# EAGLE design rj45test (EAGLE 5.09)
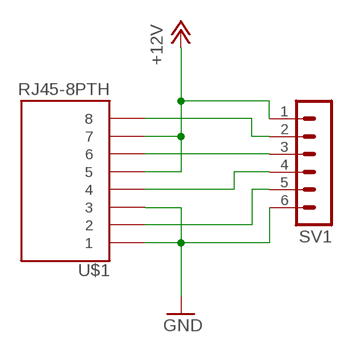
[diagram p0: schematic, sheet 1]

## Parts
SV1  MA06-1  [MA06-1]
U$1  RJ45-8PTH  [RJ45-8]

## Nets
+12V: SV1.1 U$1.5 U$1.7
GND: SV1.6 U$1.1 U$1.3
N$2: SV1.2 U$1.8
N$3: SV1.3 U$1.6
N$4: SV1.4 U$1.4
N$5: SV1.5 U$1.2

## Library data of the parts
SV1 = con-lstb:MA06-1: PIN HEADER
U$1 = SparkFun:RJ45-8: RJ45 Jack Simple RJ45, 8-pin connection - connector for common Cat5, Cat5e, and Cat6 Ethernet cables. Footprint not yet proven in production. Connector sku is PRT-00643; Breakout PCB sku is BOB-00716.

## Board
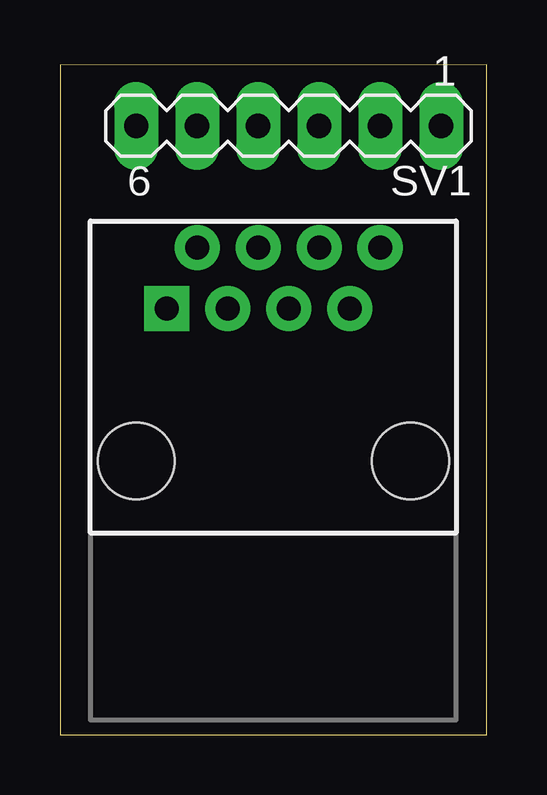
[diagram p1: board, top side]
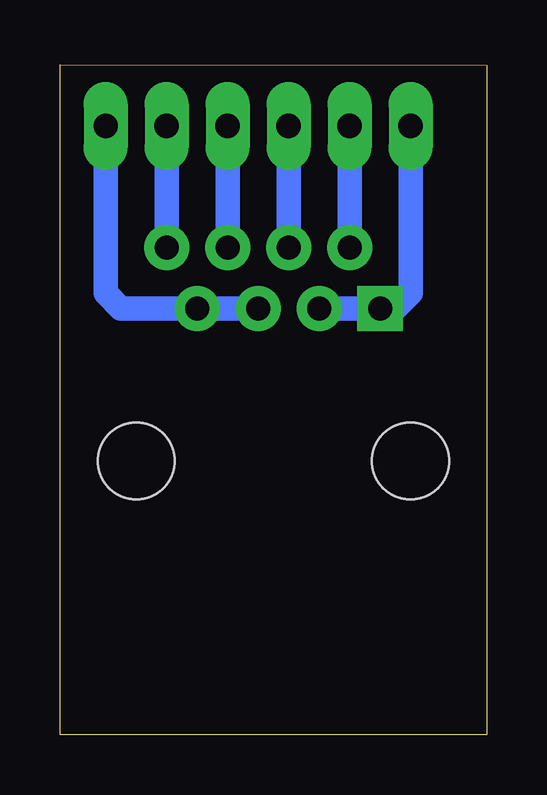
[diagram p2: board, bottom side, seen from below]

Size 17.78 x 27.94 mm. Coordinates in mm from the lower left corner, seen from the top.
Outline: 0,0 17.78,0 17.78,27.94 0,27.93 0,0
Copper layers (1*16): Top 0.035mm / dielectric 1.5mm / Bottom 0.035mm
Design rules "default *": minimum track width 10mil, minimum drill 0.6mm, track to track 8mil, track to pad 8mil, pad to pad 8mil, via to via 8mil, smd to smd 8mil, copper to edge 40mil, drill to drill 8mil, minimum pad ring 12mil, minimum via ring 8mil, stop-mask expansion 4mil, vias tented up to drill 0mil, thermal gap 10mil

### Footprints (pad centres in the part's own frame; a part is rotated, then mirrored left to right if it is on the bottom)
MA06-1 = drill 1.016 long: 1 -6.35,0; 2 -3.81,0; 3 -1.27,0; 4 1.27,0; 5 3.81,0; 6 6.35,0
RJ45-8 = drill 1 pad 1.88 square: 1 -4.445,6.35 | drill 1 pad 1.88 round: 2 -3.175,8.89; 3 -1.905,6.35; 4 -0.635,8.89; 5 0.635,6.35; 6 1.905,8.89; 7 3.175,6.35; 8 4.445,8.89 | hole 3.2: -5.715,0; 5.715,0

### Placement (x,y rotation side)
SV1  9.53,25.4 180 top
U$1  8.89,11.43 0 top

### Tracks (layer width: path | path; a pad name or v marks a point on that pad's centre or on a via)
+12V
  Bottom 1.016: U$1.5 U$1.7 15.24,17.78 15.88,18.41 SV1.1
GND
  Bottom 1.016: U$1.3 U$1.1 3.81,17.78 3.17,18.41 SV1.6
N$2
  Bottom 1.016: U$1.8 SV1.2
N$3
  Bottom 1.016: U$1.6 SV1.3
N$4
  Bottom 1.016: U$1.4 SV1.4
N$5
  Bottom 1.016: U$1.2 SV1.5